# EAGLE design nano_bt_langsung (EAGLE 9.5.0)
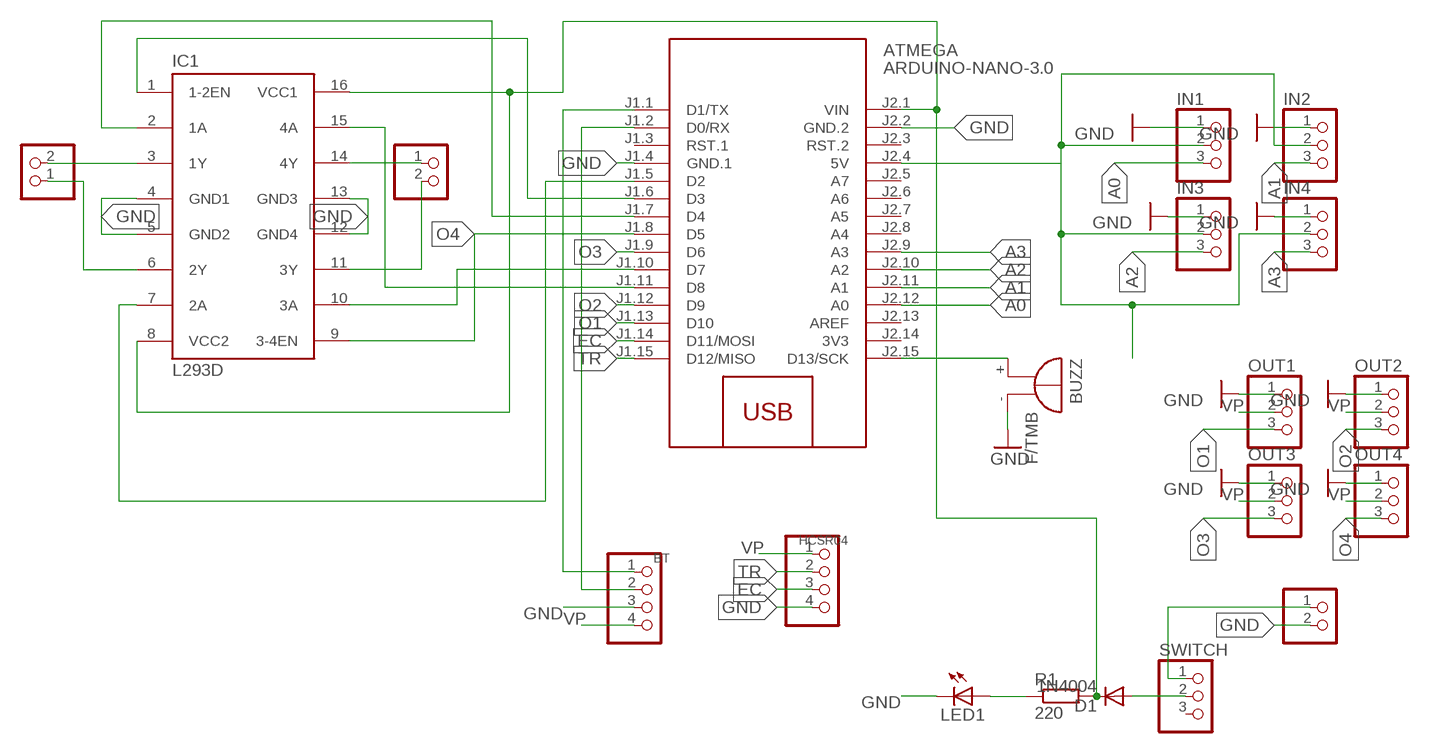
[diagram p0: schematic, sheet 1]

## Parts
ATMEGA  ARDUINO-NANO-3.0  [ARDUINO-NANO-3.0]
BT  PINHD-1X4  [1X04]
BUZZ  F/TMB  [F/TMB]
D1  1N4004  [DO41-10]
DCV  PINHD-1X2  [1X02]
HCSR04  PINHD-1X4  [1X04]
IC1  L293D  [DIL16]
IN1  PINHD-1X3  [1X03]
IN2  PINHD-1X3  [1X03]
IN3  PINHD-1X3  [1X03]
IN4  PINHD-1X3  [1X03]
LED1  LED3MM  [LED3MM]
MT1  PINHD-1X2  [1X02]
MT2  PINHD-1X2  [1X02]
OUT1  PINHD-1X3  [1X03]
OUT2  PINHD-1X3  [1X03]
OUT3  PINHD-1X3  [1X03]
OUT4  PINHD-1X3  [1X03]
R1  220  R-EU_0204/7  [0204/7]
SWITCH  PINHD-1X3  [1X03]

## Nets
A0: ATMEGA.J2.12(A0) IN1.3
A1: ATMEGA.J2.11(A1) IN2.3
A2: ATMEGA.J2.10(A2) IN3.3
A3: ATMEGA.J2.9(A3) IN4.3
EC: ATMEGA.J1.14(D11/MOSI) HCSR04.3
GND: ATMEGA.J1.4(GND.1) ATMEGA.J2.2(GND.2) BT.3 BUZZ.- DCV.2 HCSR04.4 IC1.4(GND1) IC1.5(GND2) IC1.12(GND4) IC1.13(GND3) IN1.1 IN2.1 IN3.1 IN4.1 LED1.K(C) OUT1.1 OUT2.1 OUT3.1 OUT4.1
N$1: IC1.3(1Y) MT1.2
N$2: IC1.6(2Y) MT1.1
N$3: IC1.14(4Y) MT2.1
N$4: IC1.11(3Y) MT2.2
N$5: ATMEGA.J1.1(D1/TX) BT.1
N$6: ATMEGA.J1.2(D0/RX) BT.2
N$7: ATMEGA.J2.15(D13/SCK) BUZZ.+
N$8: ATMEGA.J2.1(VIN) D1.C IC1.8(VCC2) IC1.16(VCC1) R1.2
N$9: ATMEGA.J1.5(D2) IC1.7(2A)
N$10: ATMEGA.J1.6(D3) IC1.1(1-2EN)
N$11: ATMEGA.J1.7(D4) IC1.2(1A)
N$12: DCV.1 SWITCH.1
N$13: ATMEGA.J1.10(D7) IC1.10(3A)
N$14: ATMEGA.J1.11(D8) IC1.15(4A)
N$15: D1.A SWITCH.2
N$16: LED1.A R1.1
O1: ATMEGA.J1.13(D10) OUT1.3
O2: ATMEGA.J1.12(D9) OUT2.3
O3: ATMEGA.J1.9(D6) OUT3.3
O4: ATMEGA.J1.8(D5) IC1.9(3-4EN) OUT4.3
TR: ATMEGA.J1.15(D12/MISO) HCSR04.2
VP: ATMEGA.J2.4(5V) BT.4 HCSR04.1 IN1.2 IN2.2 IN3.2 IN4.2 OUT1.2 OUT2.2 OUT3.2 OUT4.2
Unconnected: ATMEGA.J1.3(RST.1) ATMEGA.J2.3(RST.2) ATMEGA.J2.5(A7) ATMEGA.J2.6(A6) ATMEGA.J2.7(A5) ATMEGA.J2.8(A4) ATMEGA.J2.13(AREF) SWITCH.3

## Power pins joined to a net without a drawn wire
3V3: ATMEGA.J2.14(3V3)

## Library data of the parts
ATMEGA = diy-modules:ARDUINO-NANO-3.0: Arduino Nano 3.0 and compatible devices More details available here: https://www.arduino.cc/en/Main/ArduinoBoardNano Click here to find device on ebay.com <http://www.ebay.com/sch/arduino+nano>
BT HCSR04 = pinhead:PINHD-1X4: PIN HEADER
BUZZ = buzzer:F/TMB: BUZZER Source: Buerklin; OC_FARNELL: unknown; OC_NEWARK: unknown
D1 = adafruit_arduino:1N4004: DIODE General purpose 1N400x type rectifier (With bigger pads) http://www.ladyada.net/library/pcb/eaglelibrary.html
DCV MT1 MT2 = pinhead:PINHD-1X2: PIN HEADER
IC1 = st-microelectronics:L293D: PUSH-PULL 4 CHANNEL DRIVER; MPN: L293D; OC_FARNELL: 9589619; OC_NEWARK: 56P8249
IN1-IN4 OUT1-OUT4 = adafruit:PINHD-1X3: PIN HEADER
LED1 = adafruit_arduino:LED: LED OSRAM: - CHIPLED LG R971, LG N971, LY N971, LG Q971, LY Q971, LO R971, LY R971 LH N974, LH R974 LS Q976, LO Q976, LY Q976 LO Q996 - Hyper CHIPLED LW Q18S LB Q993, LB Q99A, LB R99A - SideLED LS A670, LO A670, LY A670, LG A670, LP A670 LB A673, LV A673, LT A673, LW A673 LH A674 LY A675 LS A676, LA A676, LO A676, LY A676, LW A676 LS A679, LY A679, LG A679 - Hyper Micro SIDELED® LS Y876, LA Y876, LO Y876, LY Y876 LT Y87S - SmartLED LW L88C, LW L88S LB L89C, LB L89S, LG L890 LS L89K, LO L89K, LY L89K LS L896, LA L896, LO L896, LY L896 - TOPLED LS T670, LO T670, LY T670, LG T670, LP T670 LSG T670, LSP T670, LSY T670, LOP T670, LYG T670 LG T671, LOG T671, LSG T671 LB T673, LV T673, LT T673, LW T673 LH T674 LS T676, LA T676, LO T676, LY T676, LB T676, LH T676, LSB T676, LW T676 LB T67C, LV T67C, LT T67C, LS T67K, LO T67K, LY T67K, LW E67C LS E67B, LA E67B, LO E67B, LY E67B, LB E67C, LV E67C, LT E67C LW T67C LS T679, LY T679, LG T679 LS T770, LO T770, LY T770, LG T770, LP T770 LB T773, LV T773, LT T773, LW T773 LH T774 LS E675, LA E675, LY E675, LS T675 LS T776, LA T776, LO T776, LY T776, LB T776 LHGB T686 LT T68C, LB T68C - Hyper Mini TOPLED® LB M676 - Mini TOPLED Santana® LG M470 LS M47K, LO M47K, LY M47K Source: http://www.osram.convergy.de/
R1 = rcl:R-EU_: RESISTOR, European symbol; SPICEPREFIX: R
SWITCH = adafruit_arduino:PINHD-1X3: PIN HEADER

## Board
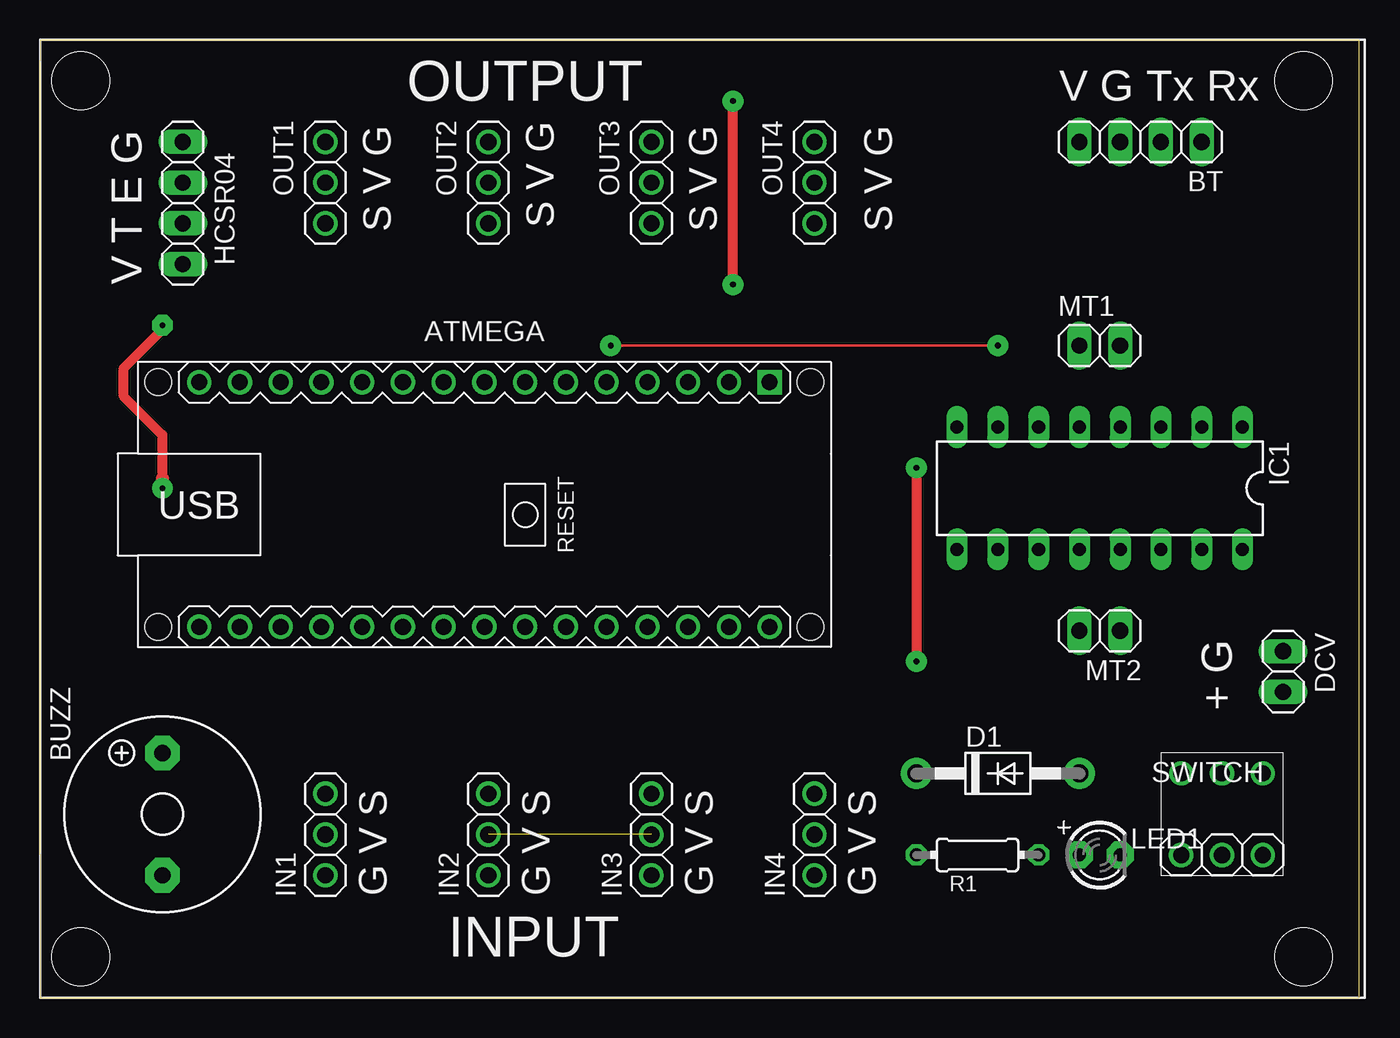
[diagram p1: board, top side]
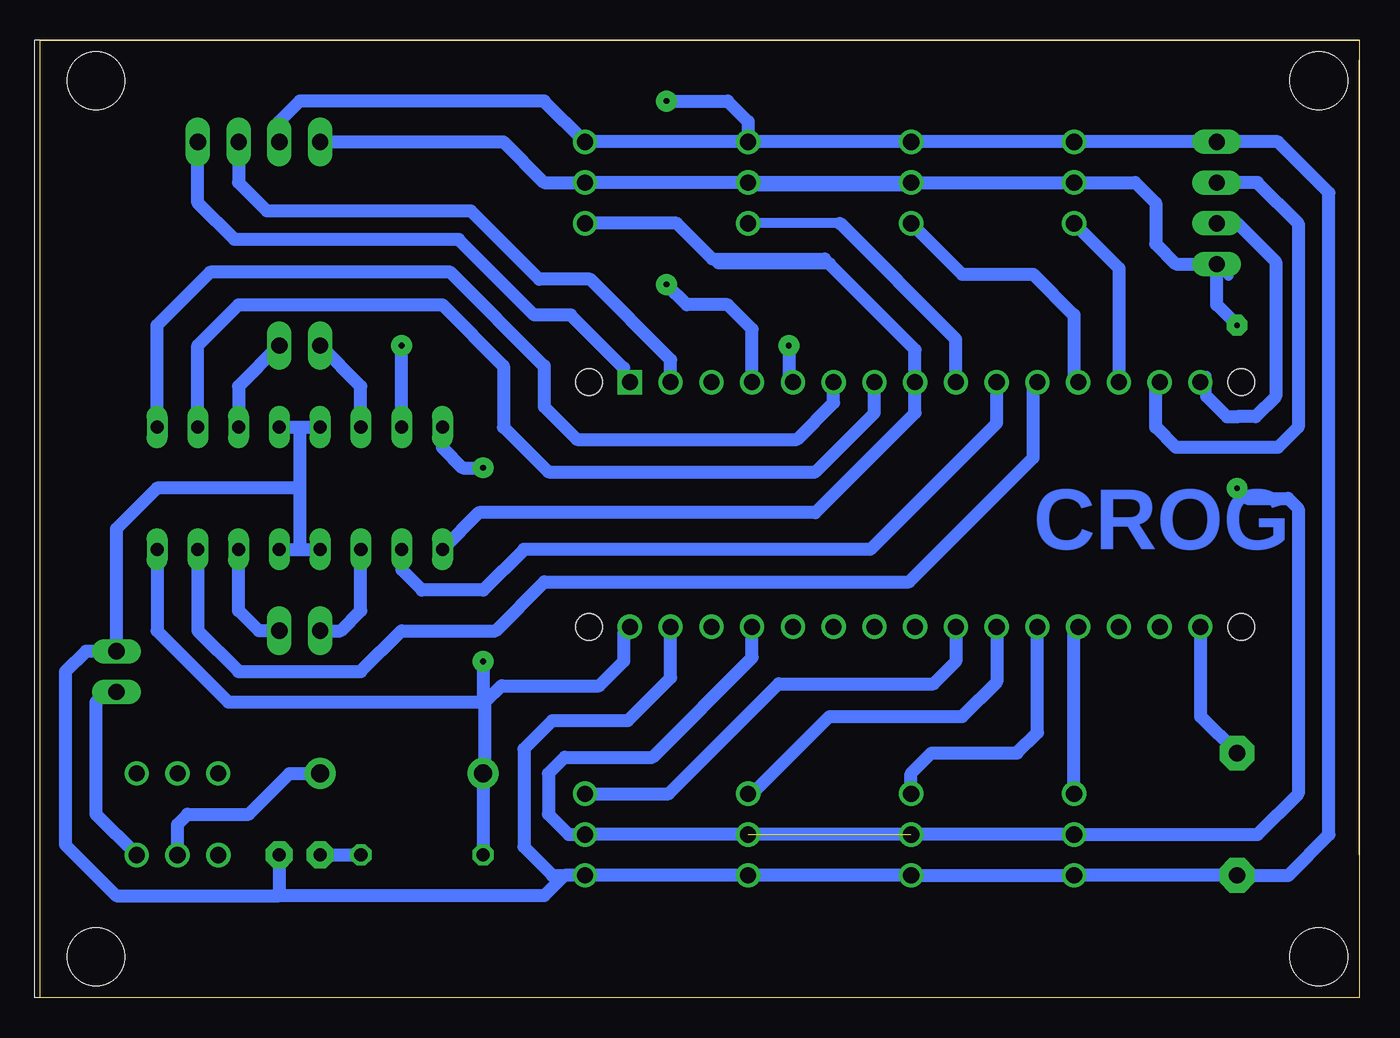
[diagram p2: board, bottom side, seen from below]

Size 82.22 x 59.68 mm. Coordinates in mm from the lower left corner, seen from the top.
Outline: 0,0 82.22,0 82.22,59.68 0,59.68 0,58.42 0,8.89 0,0
Copper layers (1*16): Top 0.035mm / dielectric 1.5mm / Bottom 0.035mm
Design rules "default": minimum track width 6mil, minimum drill 0.35mm, track to track 6mil, track to pad 6mil, pad to pad 6mil, via to via 6mil, smd to smd 6mil, copper to edge 40mil, drill to drill 6mil, minimum pad ring 10mil, minimum via ring 8mil, stop-mask expansion 4mil, vias tented up to drill 0mil, thermal gap 10mil

### Footprints (pad centres in the part's own frame; a part is rotated, then mirrored left to right if it is on the bottom)
ARDUINO-NANO-3.0 = drill 1 square: J1.1 17.78,7.62 | drill 1: J1.2 15.24,7.62; J1.3 12.7,7.62; J1.4 10.16,7.62; J1.5 7.62,7.62; J1.6 5.08,7.62; J1.7 2.54,7.62; J1.8 0,7.62; J1.9 -2.54,7.62; J1.10 -5.08,7.62; J1.11 -7.62,7.62; J1.12 -10.16,7.62; J1.13 -12.7,7.62; J1.14 -15.24,7.62; J1.15 -17.78,7.62; J2.1 17.78,-7.62; J2.2 15.24,-7.62; J2.3 12.7,-7.62; J2.4 10.16,-7.62; J2.5 7.62,-7.62; J2.6 5.08,-7.62; J2.7 2.54,-7.62; J2.8 0,-7.62; J2.9 -2.54,-7.62; J2.10 -5.08,-7.62; J2.11 -7.62,-7.62; J2.12 -10.16,-7.62; J2.13 -12.7,-7.62; J2.14 -15.24,-7.62; J2.15 -17.78,-7.62 | hole 1.651: -20.32,7.62; -20.32,-7.62; 20.32,-7.62; 20.32,7.62
1X04 = drill 1.016 long: 1 -3.81,0; 2 -1.27,0; 3 1.27,0; 4 3.81,0
F/TMB = drill 1.016 pad 2.159 octagon: + 3.81,0; - -3.81,0
DO41-10 = drill 1.118 pad 1.93: A 5.08,0; C -5.08,0
1X02 = drill 1.016 long: 1 -1.27,0; 2 1.27,0
DIL16 = drill 0.813 long: 1 -8.89,-3.81; 2 -6.35,-3.81; 3 -3.81,-3.81; 4 -1.27,-3.81; 5 1.27,-3.81; 6 3.81,-3.81; 7 6.35,-3.81; 8 8.89,-3.81; 9 8.89,3.81; 10 6.35,3.81; 11 3.81,3.81; 12 1.27,3.81; 13 -1.27,3.81; 14 -3.81,3.81; 15 -6.35,3.81; 16 -8.89,3.81
1X03 = drill 1.016: 1 -2.54,0; 2 0,0; 3 2.54,0
LED3MM = drill 0.813 pad 1.676 octagon: A -1.27,0; K 1.27,0
0204/7 = drill 0.813 octagon: 1 -3.81,0; 2 3.81,0

### Placement (x,y rotation side)
ATMEGA  27.69,30.73 0 top
BT  68.58,53.34 180 top
BUZZ  7.62,11.43 90 top
D1  59.69,13.97 0 top
DCV  77.47,20.32 90 top
HCSR04  8.89,49.53 90 top
IC1  66.04,31.75 180 top
IN1  17.78,10.16 90 top
IN2  27.94,10.16 90 top
IN3  38.1,10.16 90 top
IN4  48.26,10.16 90 top
LED1  66.04,8.89 0 top
MT1  66.04,40.64 0 top
MT2  66.04,22.86 180 top
OUT1  17.78,50.8 270 top
OUT2  27.94,50.8 270 top
OUT3  38.1,50.8 270 top
OUT4  48.26,50.8 270 top
R1  58.42,8.89 180 top
SWITCH  73.66,8.89 180 top

### Tracks (layer width: path | path; a pad name or v marks a point on that pad's centre or on a via)
A0
  Bottom 0.61: 17.78,22.86 ATMEGA.J2.12
  Bottom 0.813: IN1.3 17.78,22.86
A1
  Bottom 0.813: ATMEGA.J2.11 20.07,16.51 21.34,15.24 26.67,15.24 27.94,13.97 IN2.3
A2
  Bottom 0.61: IN3.3 37.85,12.7
  Bottom 0.813: ATMEGA.J2.10 22.61,19.68 24.77,17.53 33.02,17.53 37.85,12.7
A3
  Bottom 0.813: ATMEGA.J2.9 25.15,20.95 26.54,19.56 36.2,19.56 43.05,12.7 IN4.3
EC
  Bottom 0.61: 12.7,38.1 ATMEGA.J1.14
  Bottom 0.813: HCSR04.3 6.35,50.8 3.81,48.26 3.81,35.56 5.08,34.29 11.43,34.29 12.7,35.56 12.7,38.1
GND  (via drill 0.35 pad 1.3)
  Top 0.61: v43.18,44.45 v43.18,55.88
  Bottom 0.61: 67.31,54.61 BT.3
  Bottom 0.813: 49.53,7.62 IN4.1 IN3.1 IN2.1 IN1.1 BUZZ.- 4.45,7.62 1.91,10.16 1.91,50.16 5.08,53.34 HCSR04.4 OUT1.1 OUT2.1 OUT3.1 | 49.53,7.62 50.8,6.35 67.31,6.35 | OUT3.1 OUT4.1 50.8,55.88 66.04,55.88 67.31,54.61 | 49.53,7.62 50.29,7.62 52.07,9.4 52.07,15.49 50.29,17.27 45.59,17.27 42.93,19.94 ATMEGA.J2.2 | IC1.4 66.04,35.56 | 66.04,35.56 IC1.5 | 66.04,35.56 66.04,31.75 | 66.04,31.75 66.04,27.94 | 66.04,27.94 IC1.12 | IC1.13 66.04,27.94 | v43.18,55.88 39.37,55.88 38.1,54.61 OUT3.1 | 67.31,6.35 77.47,6.35 80.64,9.53 80.64,20.32 79.38,21.59 DCV.2 77.47,29.21 74.93,31.75 66.04,31.75 | LED1.K 67.31,6.35 | ATMEGA.J1.4 37.85,41.66 39.37,43.18 41.91,43.18 v43.18,44.45
N$1
  Bottom 0.813: MT1.2 69.85,38.1 IC1.3
N$2
  Bottom 0.813: IC1.6 62.23,38.1 MT1.1
N$3
  Bottom 0.813: MT2.1 68.58,22.86 69.85,24.13 IC1.14
N$4
  Bottom 0.813: MT2.2 63.5,22.86 62.23,24.13 IC1.11
N$5
  Bottom 0.61: 45.86,38.75 45.86,39.24
  Bottom 0.813: BT.1 72.39,49.53 70.1,47.24 56.13,47.24 51.44,42.55 49.16,42.55 45.86,39.24 | ATMEGA.J1.1 45.86,38.75
N$6
  Bottom 0.813: BT.2 69.85,50.8 68.07,49.02 55.37,49.02 51.12,44.77 47.94,44.77 42.93,39.75 ATMEGA.J1.2
N$7
  Bottom 0.813: ATMEGA.J2.15 9.91,17.53 BUZZ.+
N$8  (via drill 0.35 pad 1.3)
  Top 0.61: v54.61,33.02 v54.61,20.95
  Bottom 0.61: ATMEGA.J2.1 45.86,22.72 | D1.C 54.48,14.1 | 54.61,18.54 54.48,18.41
  Bottom 0.813: D1.C R1.2 | 45.86,22.72 45.86,20.95 47.38,19.44 53.46,19.44 54.48,18.41 | IC1.16 74.93,22.86 70.48,18.41 54.48,18.41 | 54.48,14.1 54.48,18.41 | IC1.8 57.15,34.29 55.88,33.02 v54.61,33.02 | v54.61,20.95 54.61,18.54
N$9  (via drill 0.35 pad 1.3)
  Top 0.152: v59.69,40.64 v35.56,40.64
  Bottom 0.813: IC1.7 v59.69,40.64 | v35.56,40.64 35.56,38.61 ATMEGA.J1.5
N$10
  Bottom 0.813: ATMEGA.J1.6 32.77,37.08 35.05,34.8 48.77,34.8 50.8,36.83 50.8,39.37 56.64,45.21 71.63,45.21 74.93,41.91 IC1.1
N$11
  Bottom 0.813: ATMEGA.J1.7 30.23,36.45 33.91,32.77 50.55,32.77 53.34,35.56 53.34,39.37 57.15,43.18 69.85,43.18 72.39,40.64 IC1.2
N$12
  Bottom 0.61: DCV.1 78.11,19.05
  Bottom 0.813: 78.11,19.05 78.74,18.41 78.74,11.43 SWITCH.1
N$13
  Bottom 0.61: 59.69,26.67 IC1.10
  Bottom 0.813: ATMEGA.J1.10 22.61,35.81 30.48,27.94 52.07,27.94 54.61,25.4 58.42,25.4 59.69,26.67
N$14
  Bottom 0.61: ATMEGA.J1.11 20.32,38.1
  Bottom 0.813: 20.32,38.1 20.32,33.66 28.07,25.91 50.8,25.91 53.85,22.86 59.69,22.86 62.23,20.32 69.85,20.32 72.39,22.86 IC1.15
N$15
  Bottom 0.813: SWITCH.2 73.66,10.79 73.03,11.43 69.22,11.43 66.67,13.97 D1.A
N$16
  Bottom 0.813: LED1.A R1.1
N$18  (via drill 1)
  other vias: 71.12,13.97
N$19  (via drill 1)
  other vias: 73.66,13.97
N$20  (via drill 1)
  other vias: 76.2,13.97
O1
  Bottom 0.813: OUT1.3 14.99,45.47 ATMEGA.J1.13
O2
  Bottom 0.61: 17.78,38.1 ATMEGA.J1.12
  Bottom 0.813: 17.78,38.1 17.78,42.55 20.32,45.09 24.77,45.09 OUT2.3
O3
  Bottom 0.61: 32.38,48.26 OUT3.3
  Bottom 0.813: ATMEGA.J1.9 25.15,41.02 32.38,48.26
O4
  Bottom 0.61: 33.02,45.72 40.01,45.72 40.32,46.04
  Bottom 0.813: IC1.9 54.86,30.23 33.91,30.23 27.69,36.45 ATMEGA.J1.8 27.69,40.39 33.02,45.72 33.34,46.04 40.32,46.04 42.55,48.26 OUT4.3
TR
  Bottom 0.61: 9.51,38.75 ATMEGA.J1.15 9.51,37.96 9.51,37.47 | 7.61,36.21 7.62,36.2
  Bottom 0.813: HCSR04.2 7.62,48.26 5.22,45.86 5.22,37.47 6.48,36.21 7.61,36.21 | 7.62,36.2 8.24,36.2 9.51,37.47
VP  (via drill 0.35 pad 1.3)  (1 unrouted)
  Top 0.61: 7.62,32.38 7.62,35.06 5.22,37.47 5.22,39.24 7.62,41.64 v7.62,41.91
  Top 0.813: 7.62,32.38 v7.62,31.75
  Bottom 0.61: 29.21,50.8 31.75,50.8 OUT3.2 37.85,50.55 28.45,50.55 28.19,50.8 OUT1.2 18.03,50.55 | 8.14,44.97 HCSR04.1
  Bottom 0.813: BT.4 53.34,53.34 50.8,50.8 OUT4.2 OUT3.2 OUT2.2 | ATMEGA.J2.4 37.85,21.21 44.07,14.99 49.53,14.99 50.55,13.97 50.55,11.43 49.28,10.16 IN4.2 IN3.2 IN1.2 6.35,10.16 3.81,12.7 3.81,30.48 4.45,31.11 6.99,31.11 v7.62,31.75 | v7.62,41.91 8.89,43.18 HCSR04.1 11.43,45.72 12.7,46.99 12.7,49.53 13.97,50.8 OUT1.2 OUT2.2 | OUT2.2 31.75,50.8

### Text on the board
Bottom: CROG
tNames: OUTPUT | V G Tx Rx | S V G | S V G | S V G | S V G | V T E G | + G | G V S | G V S | G V S | G V S | INPUT